# EAGLE design lcd (EAGLE 7.7.0)
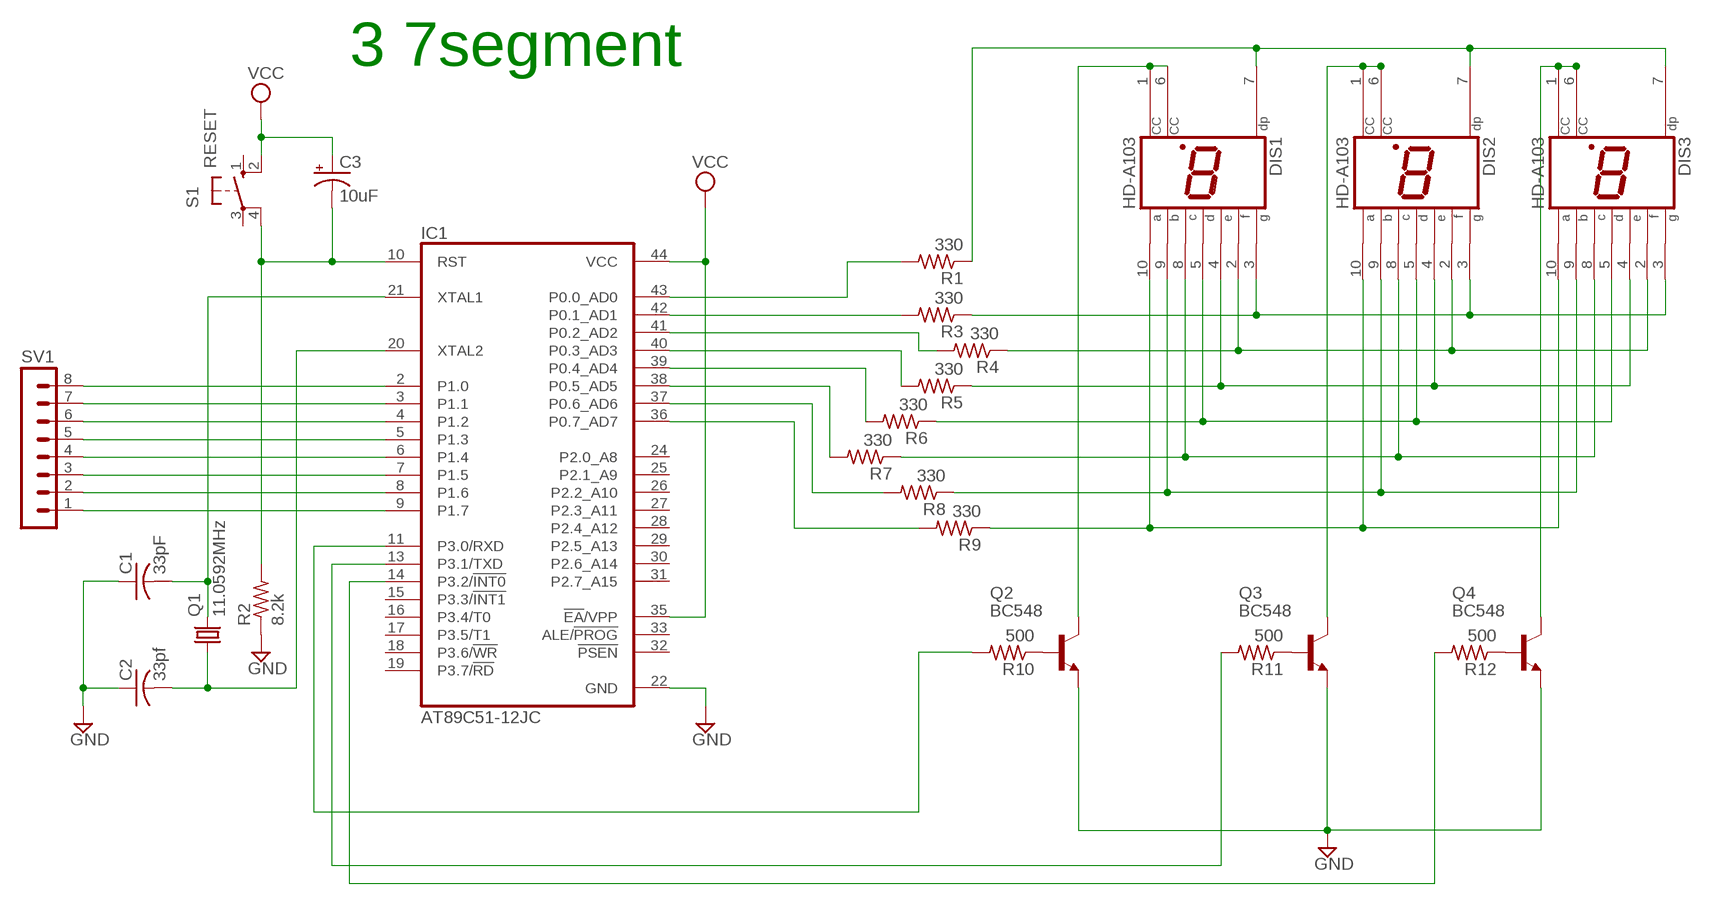
[diagram p0: schematic, sheet 1]

## Parts
C1  33pF  C-US025-025X050  [C025-025X050]
C2  33pf  C-US025-025X050  [C025-025X050]
C3  10uF  CPOL-USE2.5-5  [E2,5-5]
DIS1  HD-A103  [HDSP-A]
DIS2  HD-A103  [HDSP-A]
DIS3  HD-A103  [HDSP-A]
IC1  AT89C51-12JC  [PLCC44]
Q1  11.0592MHz  CRYSTALTC26H  [TC26H]
Q2  BC548  [TO92-EBC]
Q3  BC548  [TO92-EBC]
Q4  BC548  [TO92-EBC]
R1  330  R-US_R2512  [R2512]
R2  8.2k  R-US_R2512  [R2512]
R3  330  R-US_R2512  [R2512]
R4  330  R-US_R2512  [R2512]
R5  330  R-US_R2512  [R2512]
R6  330  R-US_R2512  [R2512]
R7  330  R-US_R2512  [R2512]
R8  330  R-US_R2512  [R2512]
R9  330  R-US_R2512  [R2512]
R10  500  R-US_R2512  [R2512]
R11  500  R-US_R2512  [R2512]
R12  500  R-US_R2512  [R2512]
S1  RESET  10-XX  [B3F-10XX]
SV1  MA08-1W  [MA08-1W]

## Nets
GND: C1.1 C2.1 IC1.22(GND) Q2.E Q3.E Q4.E R2.1
N$1: IC1.9(P1.7) SV1.1
N$2: IC1.8(P1.6) SV1.2
N$3: IC1.7(P1.5) SV1.3
N$4: IC1.6(P1.4) SV1.4
N$5: IC1.5(P1.3) SV1.5
N$6: IC1.4(P1.2) SV1.6
N$7: IC1.3(P1.1) SV1.7
N$8: IC1.2(P1.0) SV1.8
N$9: IC1.43(P0.0_AD0) R1.2
N$10: IC1.42(P0.1_AD1) R3.2
N$11: IC1.41(P0.2_AD2) R4.2
N$12: C1.2 IC1.21(XTAL1) Q1.2
N$13: C2.2 IC1.20(XTAL2) Q1.1
N$14: IC1.40(P0.3_AD3) R5.2
N$15: IC1.39(P0.4_AD4) R6.2
N$16: IC1.38(P0.5_AD5) R7.2
N$17: C3.- IC1.10(RST) R2.2 S1.4(P1)
N$18: IC1.37(P0.6_AD6) R8.2
N$19: IC1.36(P0.7_AD7) R9.2
N$20: DIS1.7(DP) DIS2.7(DP) DIS3.7(DP) R1.1
N$21: DIS1.10(A) DIS2.10(A) DIS3.10(A) R9.1
N$22: DIS1.9(B) DIS2.9(B) DIS3.9(B) R8.1
N$23: DIS2.1(CC) DIS2.6(CC) Q3.C
N$24: DIS1.5(D) DIS2.5(D) DIS3.5(D) R6.1
N$25: DIS1.4(E) DIS2.4(E) DIS3.4(E) R5.1
N$26: DIS1.2(F) DIS2.2(F) DIS3.2(F) R4.1
N$27: DIS1.3(G) DIS2.3(G) DIS3.3(G) R3.1
N$28: DIS1.8(C) DIS2.8(C) DIS3.8(C) R7.1
N$29: DIS3.1(CC) DIS3.6(CC) Q4.C
N$30: DIS1.1(CC) DIS1.6(CC) Q2.C
N$31: Q2.B R10.1
N$32: Q3.B R11.1
N$33: Q4.B R12.1
N$36: IC1.11(P3.0/RXD) R10.2
N$37: IC1.13(P3.1/TXD) R11.2
N$38: IC1.14(P3.2/!INT0) R12.2
VCC: C3.+ IC1.35(!EA!/VPP) IC1.44(VCC) S1.2(S1)
Unconnected: IC1.15(P3.3/!INT1) IC1.16(P3.4/T0) IC1.17(P3.5/T1) IC1.18(P3.6/!WR) IC1.19(P3.7/!RD) IC1.24(P2.0_A8) IC1.25(P2.1_A9) IC1.26(P2.2_A10) IC1.27(P2.3_A11) IC1.28(P2.4_A12) IC1.29(P2.5_A13) IC1.30(P2.6_A14) IC1.31(P2.7_A15) IC1.32(!PSEN) IC1.33(ALE/!PROG) S1.1(S) S1.3(P)

## Notes on the sheet
- 3 7segment

## Library data of the parts
C1 C2 = rcl:C-US: CAPACITOR, American symbol
C3 = rcl:CPOL-US: POLARIZED CAPACITOR, American symbol
DIS1-DIS3 = display-hp:HD-A103: LED DISPLAY 1-character 7 segment, decimal point right; OC_FARNELL: unknown; OC_NEWARK: unknown
IC1 = atmel:AT89C51-*: 8-bit Microcontroller with 4K Bytes Flash Not Recommended for New Designs. Use AT89S51. Source: http://www.atmel.com/dyn/resources/prod_documents/doc0265.; MPN: AT89C51ED2-SLSUM; OC_FARNELL: 1095722; OC_NEWARK: 78K5790
Q1 = crystal:CRYSTAL: CRYSTAL; OC_FARNELL: unknown; OC_NEWARK: unknown
Q2-Q4 = transistor-npn:BC548*: NPN Transistor
R1-R12 = rcl:R-US_: RESISTOR, American symbol
S1 = switch-omron:10-XX: OMRON SWITCH; MPN: B3F-1000; OC_FARNELL: 176432; OC_NEWARK: 36M3542
SV1 = con-lstb:MA08-1W: PIN HEADER; OC_FARNELL: unknown; OC_NEWARK: unknown

## Board
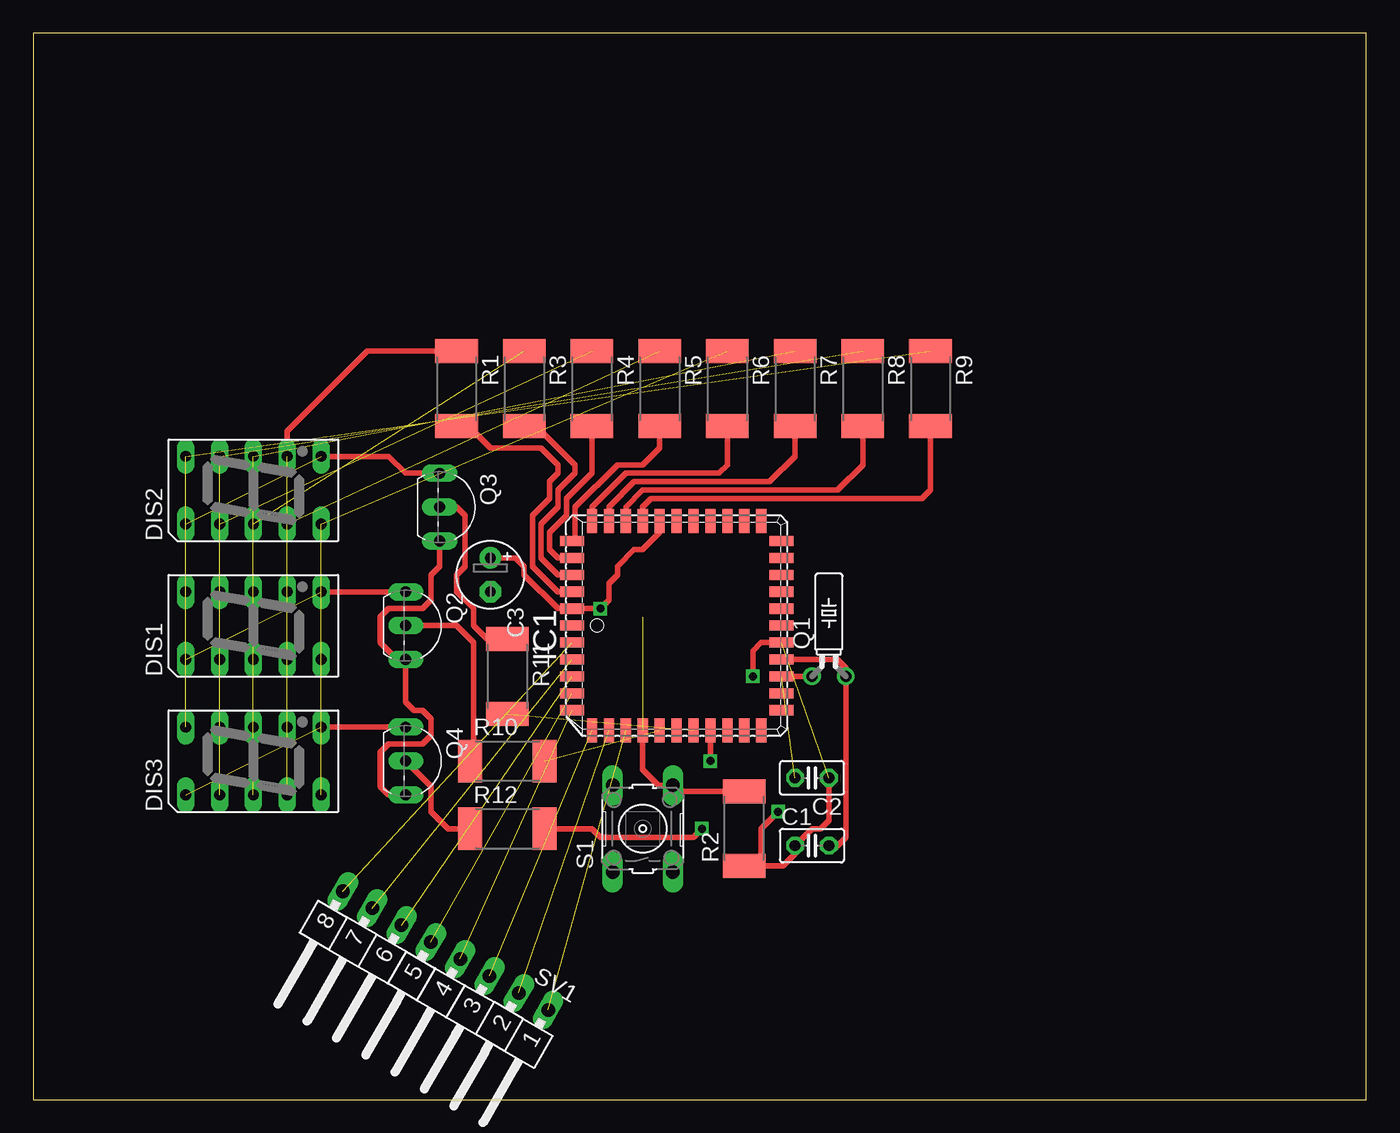
[diagram p1: board, top side]
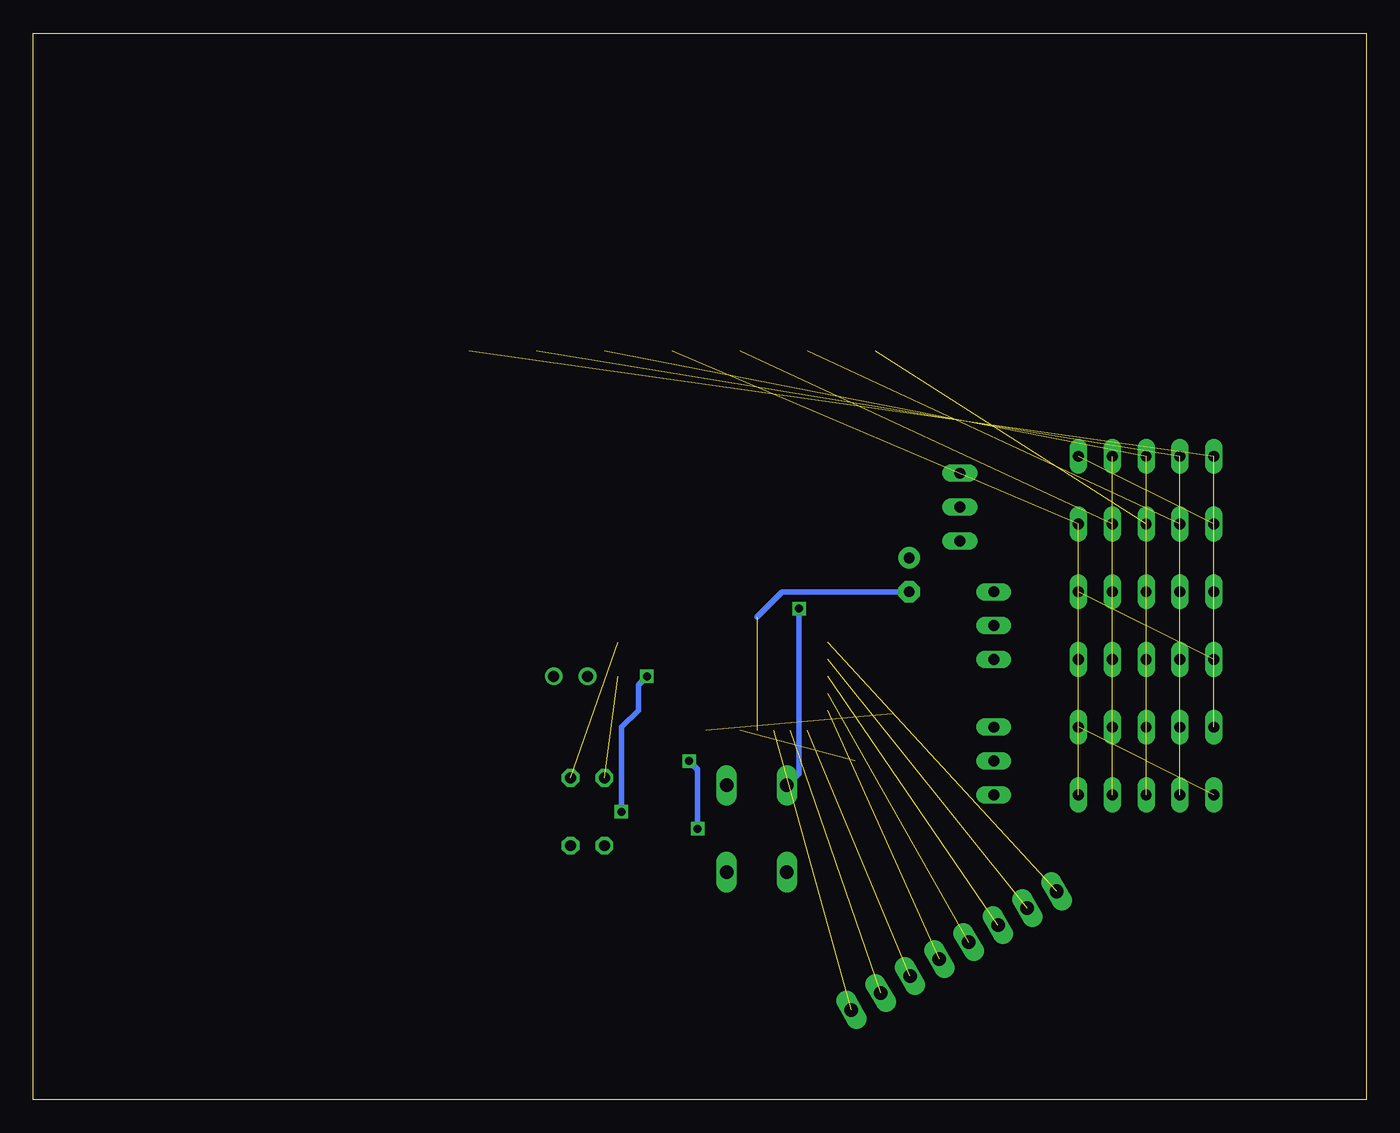
[diagram p2: board, bottom side, seen from below]

Size 100 x 80 mm. Coordinates in mm from the lower left corner, seen from the top.
Outline: 0,0 100,0 100,80 0,80 0,0
Copper layers (1*16): Top 0.035mm / dielectric 1.5mm / Bottom 0.035mm
Design rules "default": minimum track width 10mil, minimum drill 24mil, track to track 8mil, track to pad 8mil, pad to pad 8mil, via to via 8mil, smd to smd 8mil, copper to edge 40mil, drill to drill 8mil, minimum pad ring 10mil, minimum via ring 8mil, stop-mask expansion 4mil, vias tented up to drill 0mil, thermal gap 10mil

### Footprints (pad centres in the part's own frame; a part is rotated, then mirrored left to right if it is on the bottom)
C025-025X050 = drill 0.813 octagon: 1 -1.27,0; 2 1.27,0
E2,5-5 = drill 0.813 pad 1.6: + -1.27,0 | drill 0.813 pad 1.6 octagon: - 1.27,0
HDSP-A = drill 0.813 long: 1 -2.54,5.08; 2 -2.54,2.54; 3 -2.54,0; 4 -2.54,-2.54; 5 -2.54,-5.08; 6 2.54,-5.08; 7 2.54,-2.54; 8 2.54,0; 9 2.54,2.54; 10 2.54,5.08
PLCC44 = smd 1.8 x 0.76: 1 -7.86,0; 2 -7.86,-1.27; 3 -7.86,-2.54; 4 -7.86,-3.81; 5 -7.86,-5.08; 6 -7.86,-6.35; 18 7.86,-6.35; 19 7.86,-5.08; 20 7.86,-3.81; 21 7.86,-2.54; 22 7.86,-1.27; 23 7.86,0; 24 7.86,1.27; 25 7.86,2.54; 26 7.86,3.81; 27 7.86,5.08; 28 7.86,6.35; 40 -7.86,6.35; 41 -7.86,5.08; 42 -7.86,3.81; 43 -7.86,2.54; 44 -7.86,1.27 | smd 0.76 x 1.8: 7 -6.35,-7.86; 8 -5.08,-7.86; 9 -3.81,-7.86; 10 -2.54,-7.86; 11 -1.27,-7.86; 12 0,-7.86; 13 1.27,-7.86; 14 2.54,-7.86; 15 3.81,-7.86; 16 5.08,-7.86; 17 6.35,-7.86; 29 6.35,7.86; 30 5.08,7.86; 31 3.81,7.86; 32 2.54,7.86; 33 1.27,7.86; 34 0,7.86; 35 -1.27,7.86; 36 -2.54,7.86; 37 -3.81,7.86; 38 -5.08,7.86; 39 -6.35,7.86
TC26H = drill 0.813: 1 -1.27,0; 2 1.27,0
TO92-EBC = drill 0.813 long: B 0,-1.27; C -2.54,-1.27; E 2.54,-1.27
R2512 = smd 1.8 x 3.2: 1 -2.8,0; 2 2.8,0
B3F-10XX = drill 1.016 long: 1 -3.251,2.261; 2 3.251,2.261; 3 -3.251,-2.261; 4 3.251,-2.261
MA08-1W = drill 1.016 long: 1 -8.89,0; 2 -6.35,0; 3 -3.81,0; 4 -1.27,0; 5 1.27,0; 6 3.81,0; 7 6.35,0; 8 8.89,0

### Placement (x,y rotation side)
C1  58.42,19.05 0 top
C2  58.42,24.13 180 top
C3  34.29,39.37 270 top
DIS1  16.51,35.56 90 top
DIS2  16.51,45.72 90 top
DIS3  16.51,25.4 90 top
IC1  48.26,35.56 0 top
Q1  59.69,31.75 0 top
Q2  29.21,35.56 270 top
Q3  31.75,44.45 270 top
Q4  29.21,25.4 270 top
R1  31.75,53.34 270 top
R2  53.34,20.32 90 top
R3  36.83,53.34 270 top
R4  41.91,53.34 270 top
R5  46.99,53.34 270 top
R6  52.07,53.34 270 top
R7  57.15,53.34 270 top
R8  62.23,53.34 270 top
R9  67.31,53.34 270 top
R10  35.56,25.4 0 top
R11  35.56,31.75 270 top
R12  35.56,20.32 0 top
S1  45.72,20.32 90 top
SV1  30.92,11.17 150 top

### Tracks (layer width: path | path; a pad name or v marks a point on that pad's centre or on a via)
GND  (via drill 0.6)  (1 unrouted)
  Top 0.406: Q4.E 26.67,22.86 26.04,23.5 26.04,26.04 26.67,26.67 29.21,26.67 29.84,27.3 29.84,28.57 29.21,29.21 28.57,29.21 27.94,29.84 Q2.E 27.3,33.02 26.04,34.29 26.04,36.2 26.67,36.83 29.21,36.83 29.84,37.47 29.84,39.37 30.48,40.01 Q3.E | C2.1 59.69,20.95 59.05,20.32 58.42,20.32 C1.1 57.15,18.41 56.26,17.52 R2.1 54.35,17.52 54.61,17.78 54.61,20.32 v55.88,21.59 | v53.98,31.75 53.98,33.66 54.61,34.29 IC1.22
  Bottom 0.406: v55.88,21.59 55.88,27.94 54.61,29.21 54.61,31.11 v53.98,31.75
N$1  (1 unrouted)
N$2  (1 unrouted)
N$3  (1 unrouted)
N$4  (1 unrouted)
N$5  (1 unrouted)
N$6  (1 unrouted)
N$7  (1 unrouted)
N$8  (1 unrouted)
N$9
  Top 0.406: R1.2 32.65,50.54 34.29,48.9 38.1,48.9 39.37,47.62 39.37,46.99 38.73,46.35 38.73,45.09 37.47,43.81 37.47,40.01 39.37,38.1 IC1.43
N$10
  Top 0.406: R3.2 37.73,50.54 40.64,47.62 40.64,46.99 39.37,45.72 39.37,44.45 38.1,43.18 38.1,40.64 39.37,39.37 IC1.42
N$11
  Top 0.406: R4.2 41.91,46.99 40.01,45.09 40.01,43.81 38.73,42.55 38.73,41.27 39.37,40.64 IC1.41
N$12
  Top 0.406: IC1.21 60.33,33.02 60.96,32.38 Q1.2 60.96,19.68 60.33,19.05 C1.2
N$13  (1 unrouted)
  Top 0.406: Q1.1 IC1.20
N$14
  Top 0.406: R5.2 46.99,48.9 45.72,47.62 43.81,47.62 40.64,44.45 40.64,42.15 IC1.40
N$15
  Top 0.406: R6.2 52.07,47.62 51.44,46.99 44.45,46.99 41.91,44.45 IC1.39
N$16
  Top 0.406: R7.2 57.15,48.26 55.24,46.35 45.09,46.35 43.18,44.45 IC1.38
N$17  (1 unrouted)
  Top 0.406: R2.2 48.43,23.12 S1.4 46.91,23.57 45.72,24.77 IC1.10
  Bottom 0.406: C3.- 43.81,38.1 45.72,36.2
N$18
  Top 0.406: R8.2 62.23,47.62 60.33,45.72 45.72,45.72 44.45,44.45 IC1.37
N$19
  Top 0.406: R9.2 67.31,45.72 66.67,45.09 46.35,45.09 45.72,44.45 IC1.36
N$20  (2 unrouted)
  Top 0.406: R1.1 25.02,56.14 19.05,50.16 DIS2.7
N$21  (3 unrouted)
N$22  (3 unrouted)
N$23  (1 unrouted)
  Top 0.406: DIS2.6 26.67,48.26 27.94,46.99 Q3.C
N$24  (3 unrouted)
N$25  (3 unrouted)
N$26  (3 unrouted)
N$27  (3 unrouted)
N$28  (3 unrouted)
N$29  (1 unrouted)
  Top 0.406: DIS3.6 Q4.C
N$30  (1 unrouted)
  Top 0.406: DIS1.6 Q2.C
N$31
  Top 0.406: Q2.B 31.75,35.56 33.02,34.29 33.02,25.66 R10.1
N$32
  Top 0.406: Q3.B 31.75,44.45 32.38,43.81 32.38,40.01 31.75,39.37 31.75,38.1 33.02,36.83 33.02,35.56 34.03,34.55 R11.1
N$33
  Top 0.406: Q4.B 29.84,23.5 29.84,21.59 31.11,20.32 R12.1
N$36  (1 unrouted)
N$37  (1 unrouted)
N$38  (via drill 0.6)
  Top 0.406: R12.2 41.91,20.32 42.55,19.68 49.53,19.68 v50.16,20.32 | v50.8,25.4 IC1.14
  Bottom 0.406: v50.16,20.32 50.16,24.77 v50.8,25.4
VCC  (via drill 0.6)
  Top 0.406: C3.+ 36.2,40.64 36.83,40.01 36.83,39.37 39.37,36.83 IC1.44 v42.55,36.83 43.18,37.47 43.18,38.73 43.81,39.37 43.81,40.01 45.09,41.27 45.72,41.27 46.99,42.55 IC1.35
  Bottom 0.406: v42.55,36.83 42.55,24.49 S1.2